# EAGLE design DualEncoderBoard-v2.0 (EAGLE 6.5.0)
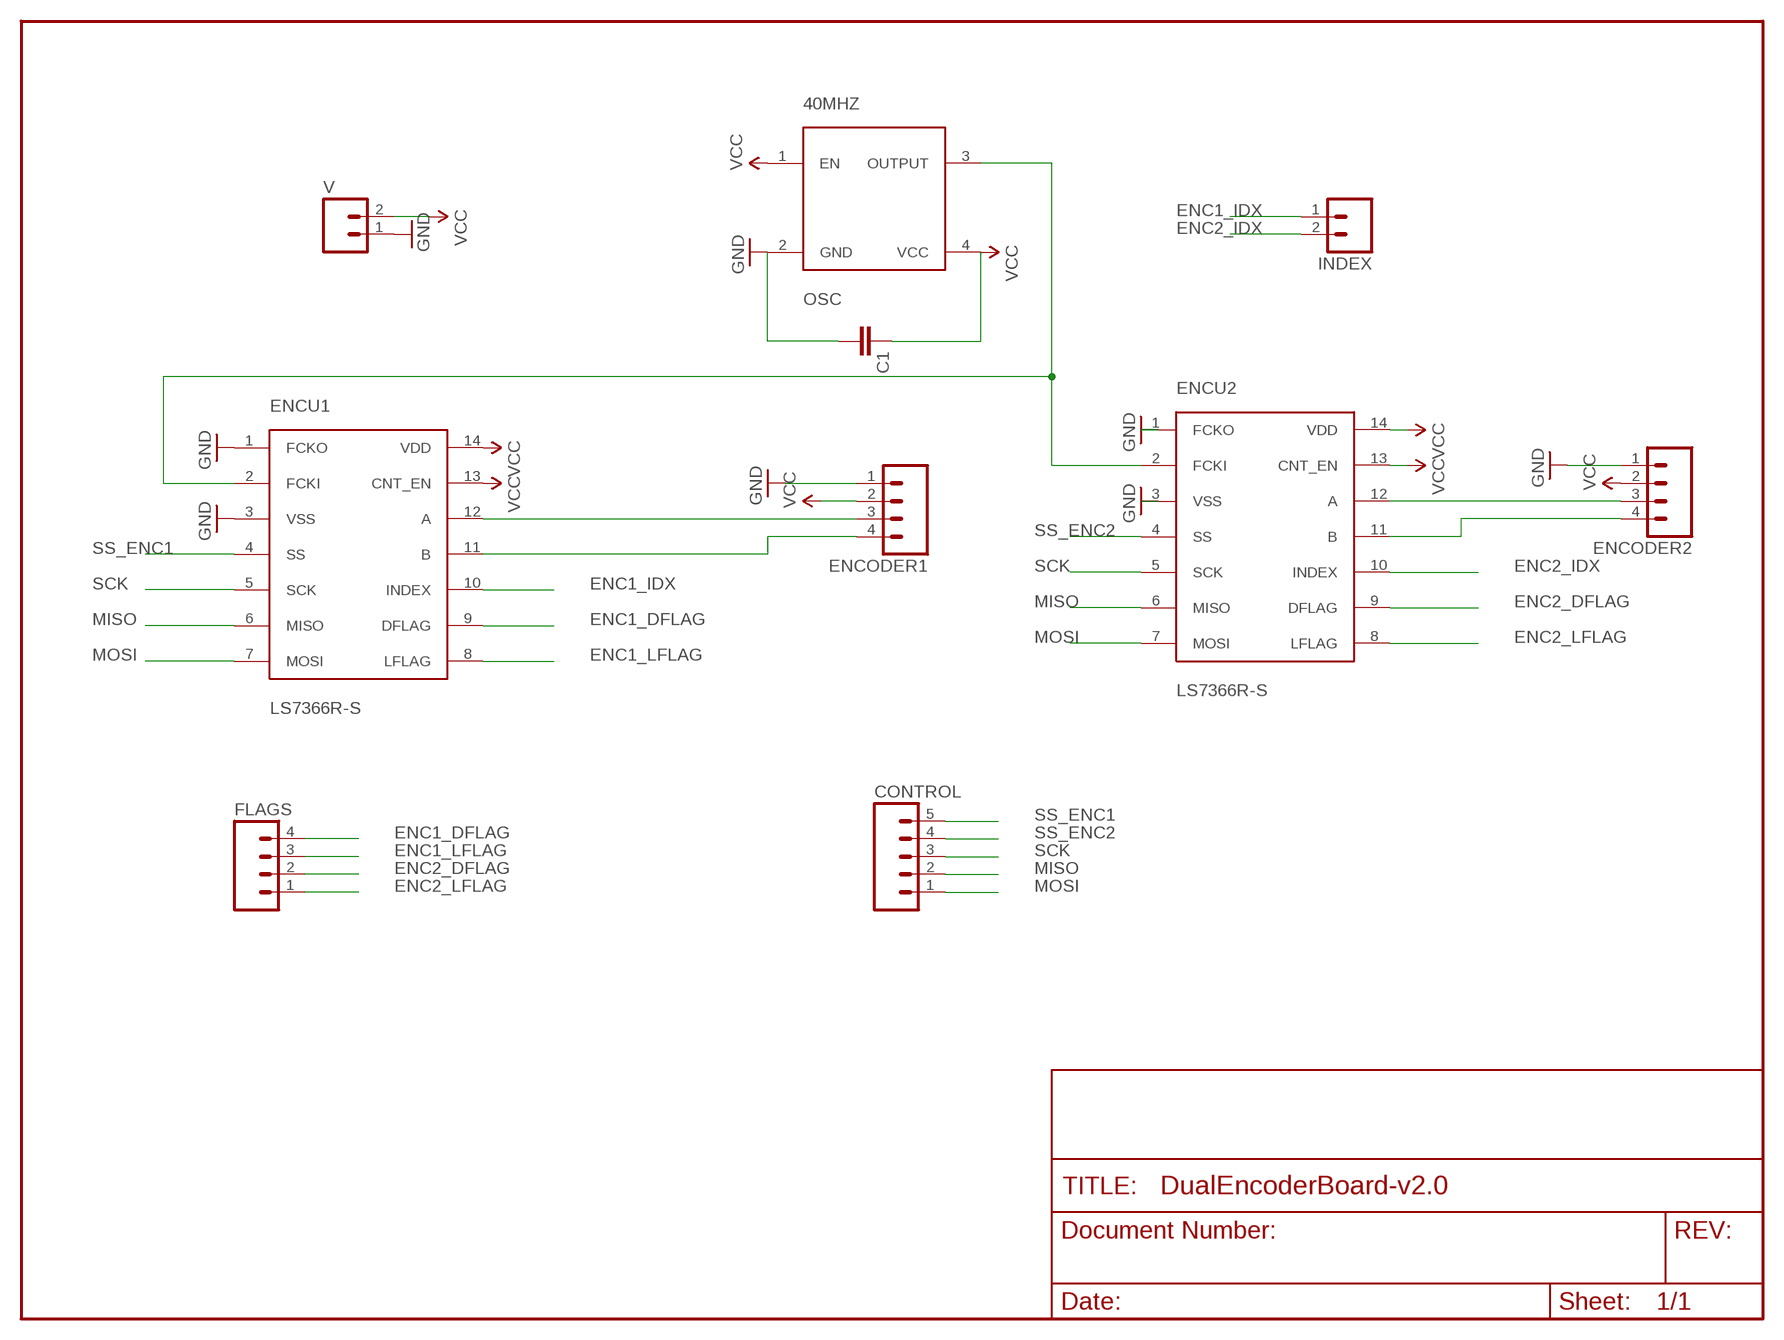
[diagram p0: schematic, sheet 1]

## Parts
40MHZ  OSC  [CB3OSCILLATOR]
C1  CAPKIT  [CAP-PTH-SMALL-KIT]
CONTROL  M05PTH  [1X05]
ENCODER1  M04POLAR  [MOLEX-1X4]
ENCODER2  M04POLAR  [MOLEX-1X4]
ENCU1  LS7366R-S  [SO14]
ENCU2  LS7366R-S  [SO14]
FLAGS  M04PTH  [1X04]
INDEX  M02PTH  [1X02]
V  M02-JST-2MM-SMT  [JST-2-SMD]

## Nets
ENC1_DFLAG: ENCU1.9(DFLAG) FLAGS.4
ENC1_IDX: ENCU1.10(INDEX) INDEX.1
ENC1_LFLAG: ENCU1.8(LFLAG) FLAGS.3
ENC2_DFLAG: ENCU2.9(DFLAG) FLAGS.2
ENC2_IDX: ENCU2.10(INDEX) INDEX.2
ENC2_LFLAG: ENCU2.8(LFLAG) FLAGS.1
GND: 40MHZ.2(GND) C1.2 ENCODER1.1 ENCODER2.1 ENCU1.1(FCKO) ENCU1.3(VSS) ENCU2.1(FCKO) ENCU2.3(VSS) V.1
MISO: CONTROL.2 ENCU1.6(MISO) ENCU2.6(MISO)
MOSI: CONTROL.1 ENCU1.7(MOSI) ENCU2.7(MOSI)
N$1: ENCODER1.3 ENCU1.12(A)
N$2: ENCODER1.4 ENCU1.11(B)
N$3: ENCODER2.3 ENCU2.12(A)
N$4: ENCODER2.4 ENCU2.11(B)
N$5: 40MHZ.3(OUTPUT) ENCU1.2(FCKI) ENCU2.2(FCKI)
SCK: CONTROL.3 ENCU1.5(SCK) ENCU2.5(SCK)
SS_ENC1: CONTROL.5 ENCU1.4(SS)
SS_ENC2: CONTROL.4 ENCU2.4(SS)
VCC: 40MHZ.1(EN) 40MHZ.4(VCC) C1.1 ENCODER1.2 ENCODER2.2 ENCU1.13(CNT_EN) ENCU1.14(VDD) ENCU2.13(CNT_EN) ENCU2.14(VDD) V.2

## Library data of the parts
40MHZ = steveo:OSC: CB3 40mhz Oscillator smd
C1 = SparkFun:CAP: Capacitor Standard 0603 ceramic capacitor, and 0.1" leaded capacitor.
CONTROL = SparkFun:M05: Header 5 Standard 5-pin 0.1" header. Use with straight break away headers (SKU : PRT-00116), right angle break away headers (PRT-00553), swiss pins (PRT-00743), machine pins (PRT-00117), and female headers (PRT-00115). Molex polarized connector foot print use with SKU : PRT-08230 with associated crimp pins and housings.
ENCODER1 ENCODER2 FLAGS = SparkFun:M04: Header 4 Standard 4-pin 0.1" header. Use with straight break away headers (SKU : PRT-00116), right angle break away headers (PRT-00553), swiss pins (PRT-00743), machine pins (PRT-00117), and female headers (PRT-00115). Molex polarized connector foot print use with SKU : PRT-08231 with associated crimp pins and housings. 1MM SMD Version SKU: PRT-10208
ENCU1 ENCU2 = steveo:LS7366R-S
INDEX V = SparkFun:M02: Header 2 Standard 2-pin 0.1" header. Use with straight break away headers (SKU : PRT-00116), right angle break away headers (PRT-00553), swiss pins (PRT-00743), machine pins (PRT-00117), and female headers (PRT-00115). Molex polarized connector foot print use with SKU : PRT-08233 with associated crimp pins and housings.

## Board
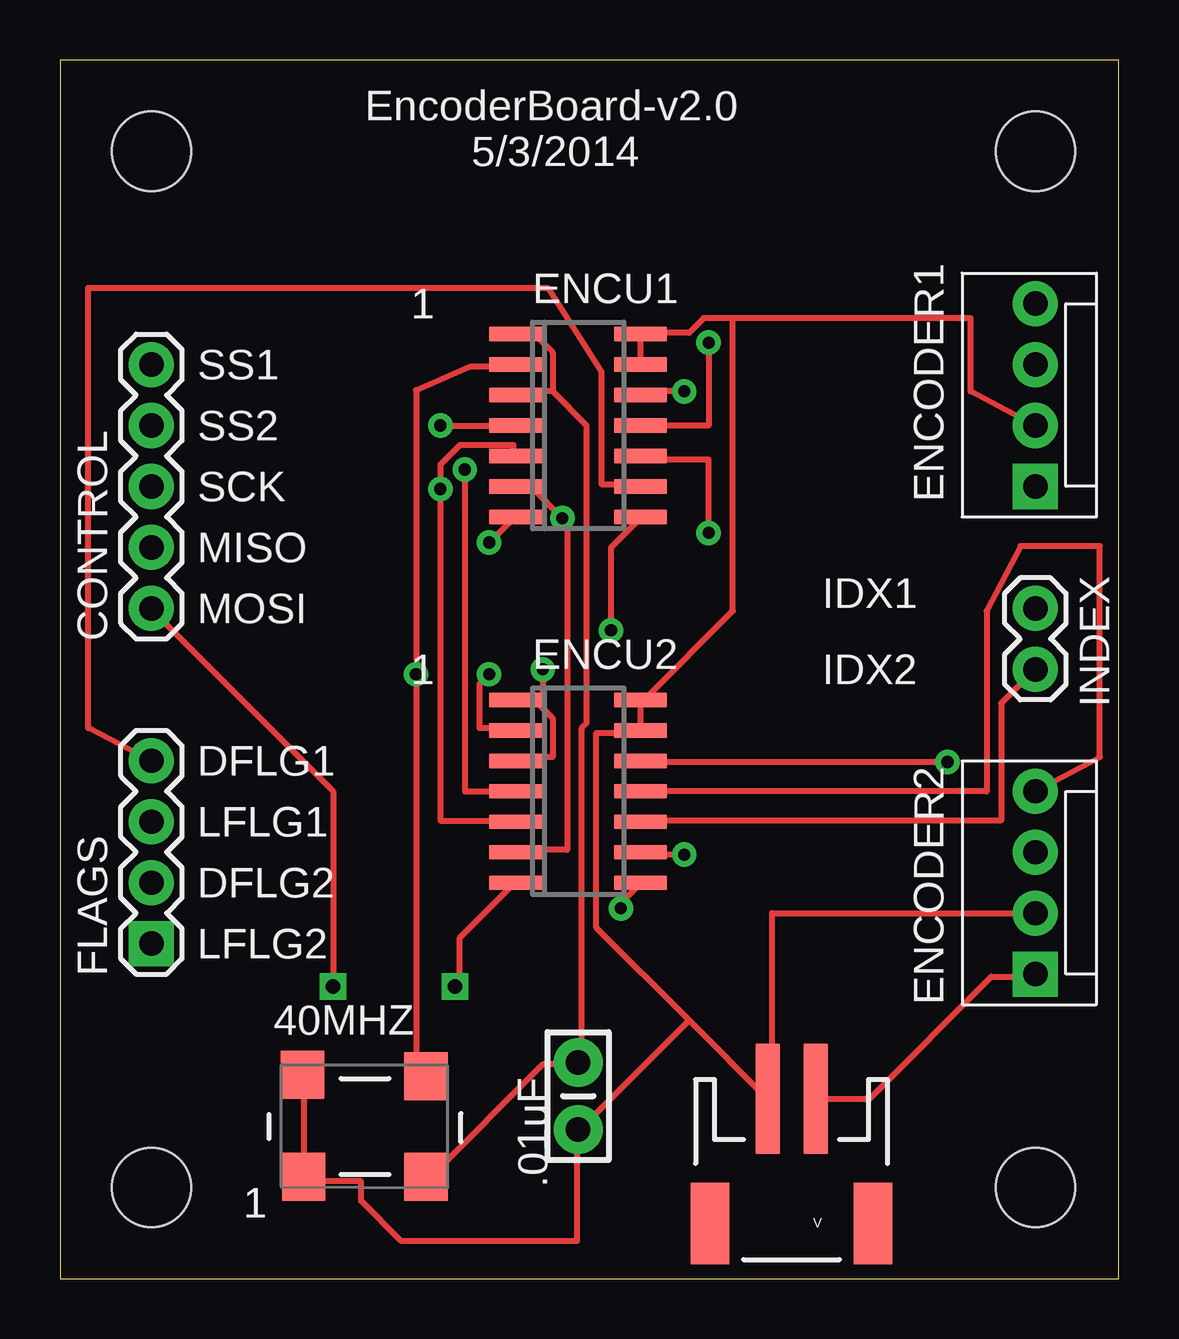
[diagram p1: board, top side]
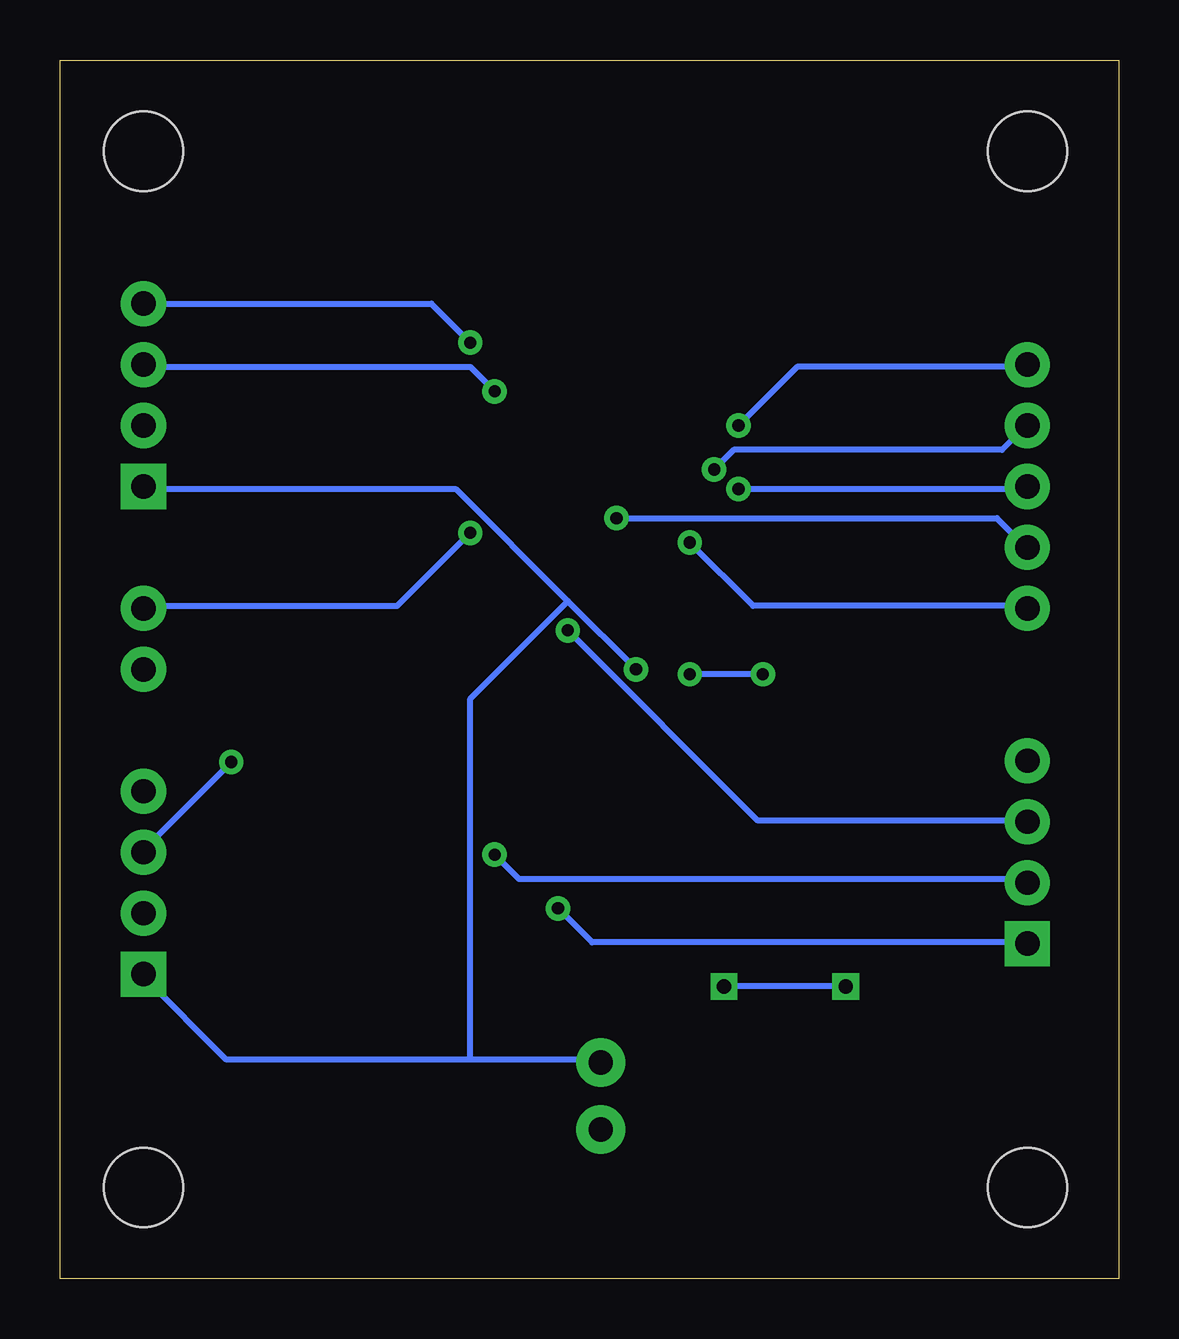
[diagram p2: board, bottom side, seen from below]

Size 44.12 x 50.79 mm. Coordinates in mm from the lower left corner, seen from the top.
Outline: 0,0 44.12,0 44.12,50.79 0,50.79 0,0
Copper layers (1*16): Top 0.035mm / dielectric 1.5mm / Bottom 0.035mm
Design rules "SparkFun": minimum track width 8mil, minimum drill 20mil, track to track 8mil, track to pad 8mil, pad to pad 8mil, via to via 8mil, smd to smd 8mil, copper to edge 8mil, drill to drill 8mil, minimum pad ring 12mil, minimum via ring 10mil, stop-mask expansion 4mil, vias tented up to drill 20mil, thermal gap 10mil

### Footprints (pad centres in the part's own frame; a part is rotated, then mirrored left to right if it is on the bottom)
CB3OSCILLATOR = smd 1.8 x 2: 1 -2.55,-2.1; 2 2.55,-2.1; 3 2.55,2.1; 4 -2.6,2.15
CAP-PTH-SMALL-KIT = drill 1.016 pad 2.032: 1 -1.397,0; 2 1.397,0
1X05 = drill 1.016 pad 1.88: 1 0,0; 2 2.54,0; 3 5.08,0; 4 7.62,0; 5 10.16,0
MOLEX-1X4 = drill 1.016 pad 1.88 square: 1 0,0 | drill 1.016 pad 1.88: 2 2.54,0; 3 5.08,0; 4 7.62,0
SO14 = smd 0.6 x 2.2: 1 -3.81,-2.6; 2 -2.54,-2.6; 3 -1.27,-2.6; 4 0,-2.6; 5 1.27,-2.6; 6 2.54,-2.6; 7 3.81,-2.6; 8 3.81,2.6; 9 2.54,2.6; 10 1.27,2.6; 11 0,2.6; 12 -1.27,2.6; 13 -2.54,2.6; 14 -3.81,2.6
1X04 = drill 1.016 pad 1.88 square: 1 0,0 | drill 1.016 pad 1.88: 2 2.54,0; 3 5.08,0; 4 7.62,0
1X02 = drill 1.016 pad 1.88: 1 0,0; 2 2.54,0
STAND-OFF = hole 3.302: 0,0
JST-2-SMD = smd 1 x 4.6: 1 -1,-3.7; 2 1,-3.7 | smd 1.6 x 3.4: NC1 -3.4,1.5; NC2 3.4,1.5

### Placement (x,y rotation side)
40MHZ  12.7,6.35 0 top
C1  21.59,7.62 90 top
CONTROL  3.81,27.94 90 top
ENCODER1  40.64,33.02 90 top
ENCODER2  40.64,12.7 90 top
ENCU1  21.59,35.56 270 top
ENCU2  21.59,20.32 270 top
FLAGS  3.81,13.97 90 top
INDEX  40.64,27.94 270 top
U$1  [STAND-OFF]  3.81,46.99 0 top
U$2  [STAND-OFF]  3.81,3.81 0 top
U$3  [STAND-OFF]  40.64,3.81 0 top
U$4  [STAND-OFF]  40.64,46.99 0 top
V  30.48,3.81 180 top

### Tracks (layer width: path | path; a pad name or v marks a point on that pad's centre or on a via)
ENC1_DFLAG
  Top 0.254: FLAGS.4 1.17,22.96 1.17,41.3 20.32,41.3 22.55,37.8 22.55,33.12 24.18,33.12 ENCU1.9
ENC1_IDX  (via drill 0.51)
  Top 0.254: v27.03,31.09 27.03,34.14 24.38,34.14 ENCU1.10
  Bottom 0.254: v27.03,31.09 30.07,28.04 40.64,28.04 INDEX.1
ENC1_LFLAG  (via drill 0.51)
  Top 0.254: v22.96,27.03 22.96,30.48 24.18,31.7 ENCU1.8
  Bottom 0.254: v22.96,27.03 15.04,19.1 3.86,19.1 FLAGS.3
ENC2_DFLAG  (via drill 0.51)
  Top 0.254: v26.01,17.68 24.38,17.68 ENCU2.9
  Bottom 0.254: v26.01,17.68 24.99,16.66 3.86,16.66 FLAGS.2
ENC2_IDX
  Top 0.254: INDEX.2 39.22,23.98 39.22,19.1 24.38,19.1 ENCU2.10
ENC2_LFLAG  (via drill 0.51)
  Top 0.254: v23.37,15.44 23.37,15.65 24.18,16.46 ENCU2.8
  Bottom 0.254: v23.37,15.44 21.95,14.02 3.86,14.02 FLAGS.1
GND  (via drill 0.51)
  Top 0.254: 19.91,23.98 20.52,23.37 20.52,21.74 19.1,21.74 ENCU2.3 | 19.91,23.98 19.1,23.98 ENCU2.1 19.91,23.98 | 19.91,23.98 20.12,24.18 v20.12,25.4 | ENCODER2.1 40.64,12.6 38.81,12.6 33.73,7.52 31.5,7.52 V.1 | 20.52,36.98 19.1,36.98 ENCU1.3 | 20.52,36.98 20.52,38.61 19.91,39.22 19.1,39.22 ENCU1.1 | 40MHZ.2 15.44,4.27 20.12,8.94 21.54,8.94 C1.2 21.74,9.14 21.74,22.96 21.95,23.16 21.95,35.56 20.52,36.98
  Bottom 0.254: 22.96,28.25 27.64,32.92 40.64,32.92 ENCODER1.1 | 22.96,28.25 v20.12,25.4 | 27.03,9.14 21.74,9.14 C1.2 | 27.03,9.14 37.19,9.14 40.64,12.6 ENCODER2.1 | 22.96,28.25 27.03,24.18 27.03,9.14
MISO  (via drill 0.51)
  Top 0.254: ENCU2.6 19.1,17.88 21.13,17.88 21.13,31.5 v20.93,31.7 19.71,32.92 19.1,32.92 ENCU1.6
  Bottom 0.254: v20.93,31.7 5.08,31.7 3.86,30.48 CONTROL.2
MOSI  (via drill 0.51, 0.6)
  Top 0.254: v16.46,12.19 16.66,12.39 16.66,14.22 18.9,16.46 ENCU2.7 | v11.38,12.19 11.38,20.32 3.86,27.84 CONTROL.1 | v17.88,30.68 18.9,31.7 ENCU1.7
  Bottom 0.254: v11.38,12.19 v16.46,12.19 | v17.88,30.68 15.24,28.04 3.86,28.04 CONTROL.1
N$1  (via drill 0.51)
  Top 0.254: v26.01,36.98 24.38,36.98 ENCU1.12
  Bottom 0.254: v26.01,36.98 27.03,38 40.64,38 ENCODER1.3
N$2  (via drill 0.51)
  Top 0.254: ENCU1.11 27.03,35.56 v27.03,39.01
  Bottom 0.254: v27.03,39.01 28.65,40.64 ENCODER1.4
N$3  (via drill 0.51)
  Top 0.254: v36.98,21.54 24.38,21.54 ENCU2.12
  Bottom 0.254: v36.98,21.54 40.64,17.88 ENCODER2.3
N$4
  Top 0.254: ENCU2.11 38.61,20.32 38.61,27.84 40.03,30.53 43.33,30.53 43.33,21.74 ENCODER2.4
N$5  (via drill 0.51)
  Top 0.254: 40MHZ.3 15.24,8.53 14.83,8.94 v14.83,25.2 14.83,37.03 17.07,38 18.9,38 ENCU1.2 | v17.88,25.2 17.48,24.79 17.48,22.96 18.9,22.96 ENCU2.2
  Bottom 0.254: v14.83,25.2 v17.88,25.2
SCK  (via drill 0.51)
  Top 0.254: ENCU2.5 18.9,19.1 15.85,19.1 v15.85,32.92 15.85,33.93 16.66,34.75 18.9,34.75 18.9,34.34 ENCU1.5
  Bottom 0.254: v15.85,32.92 3.86,32.92 CONTROL.3
SS_ENC1  (via drill 0.51)
  Top 0.254: v15.85,35.56 ENCU1.4
  Bottom 0.254: v15.85,35.56 13.41,38 3.86,38 CONTROL.5
SS_ENC2  (via drill 0.51)
  Top 0.254: ENCU2.4 16.87,20.32 v16.87,33.73
  Bottom 0.254: v16.87,33.73 16.05,34.54 4.88,34.54 3.86,35.56 CONTROL.4
VCC
  Top 0.254: ENCU1.13 24.18,38.2 24.18,39.22 ENCU1.14 24.38,39.42 26.21,39.42 26.82,40.03 28.04,40.03 | 28.04,40.03 37.95,40.03 37.95,36.98 ENCODER1.2 | 40MHZ.4 10.16,8.33 10.16,4.27 40MHZ.1 10.16,4.06 12.55,4.06 12.55,3.25 14.22,1.57 21.54,1.57 21.54,6.1 C1.1 21.74,6.3 26.21,10.77 | 26.21,10.77 29.46,7.52 V.2 29.67,7.52 29.67,15.24 ENCODER2.2 | 26.21,10.77 22.35,14.63 22.35,22.76 24.18,22.76 ENCU2.13 24.18,22.96 24.18,23.98 ENCU2.14 24.38,24.18 28.04,27.84 28.04,40.03

### Text on the board
tPlace: EncoderBoard-v2.0 | 5/3/2014 | 1 | SS1 | SS2 | SCK | ENCODER1 | MISO | IDX1 | MOSI | 1 | IDX2 | DFLG1 | LFLG1 | DFLG2 | LFLG2 | ENCODER2 | .01uF | 1